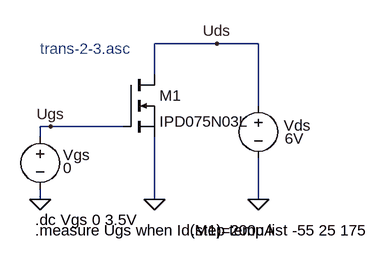
[diagram p0: schematic trans-2-3.asc]
trans-2-3.asc, the LTspice schematic file:
Version 4
SHEET 1 1292 680
WIRE -624 -176 -720 -176
WIRE -560 -176 -624 -176
WIRE -720 -128 -720 -176
WIRE -560 -80 -560 -176
WIRE -880 -48 -896 -48
WIRE -768 -48 -880 -48
WIRE -896 -32 -896 -48
WIRE -896 64 -896 48
WIRE -720 64 -720 -32
WIRE -560 64 -560 0
FLAG -560 64 0
FLAG -896 64 0
FLAG -720 64 0
FLAG -880 -48 Ugs
FLAG -624 -176 Uds
SYMBOL voltage -560 -96 R0
WINDOW 123 0 0 Left 2
WINDOW 39 39 62 Left 2
WINDOW 0 39 46 Left 2
WINDOW 3 41 66 Left 2
SYMATTR InstName Vds
SYMATTR Value 6V
SYMBOL voltage -896 -48 R0
WINDOW 123 0 0 Left 2
WINDOW 39 35 80 Left 2
WINDOW 3 35 64 Left 2
WINDOW 0 35 44 Left 2
SYMATTR Value 0
SYMATTR InstName Vgs
SYMBOL nmos -768 -128 R0
SYMATTR InstName M1
SYMATTR Value IPD075N03L
TEXT -904 96 Left 2 !.dc Vgs 0 3.5V
TEXT -904 112 Left 2 !.measure Ugs when Id(M1)=200uA
TEXT -664 112 Left 2 !.step temp list -55 25 175
TEXT -896 -168 Left 2 ;trans-2-3.asc

The netlist it stands for:
* trans-2-3.asc
Vds Uds 0 6V
Vgs Ugs 0 0
M1 Uds Ugs 0 0 IPD075N03L
.model NMOS NMOS
.model PMOS PMOS
.lib standard.mos
.dc Vgs 0 3.5V
.measure Ugs when Id(M1)=200uA
.step temp list -55 25 175
* trans-2-3.asc
.backanno
.end